# EAGLE design what-the-frequency-mk-5 (EAGLE 6.5.0)
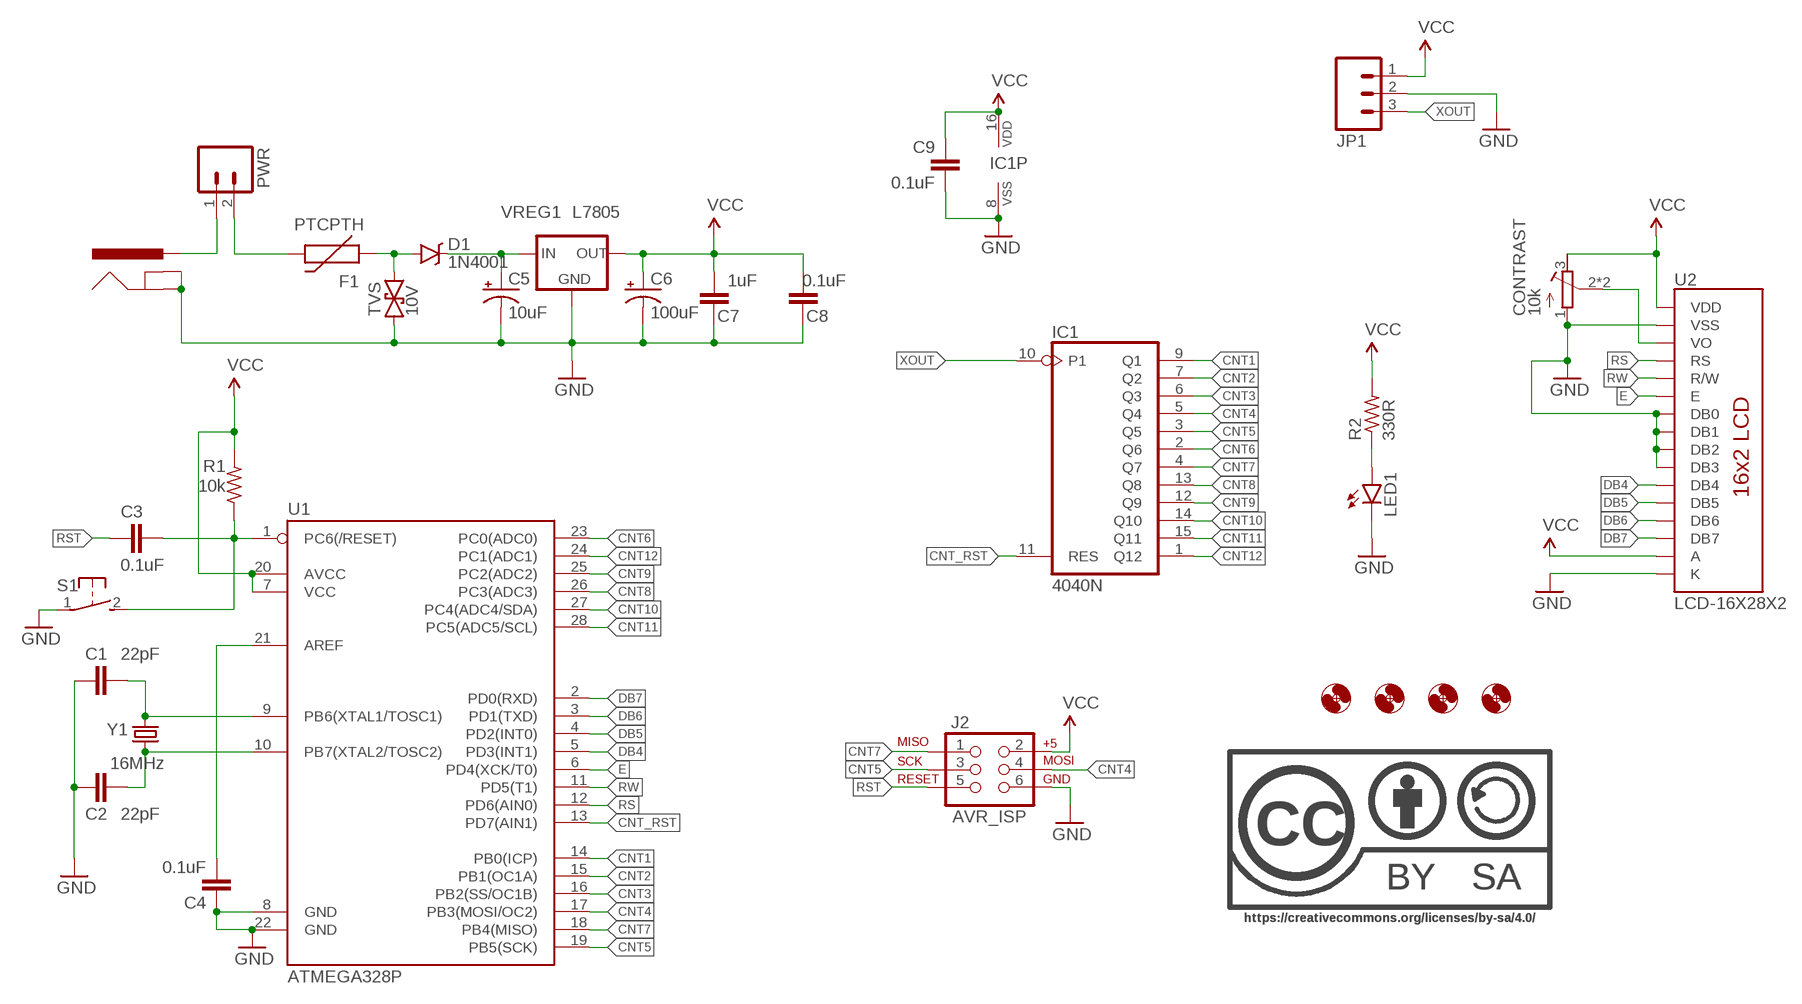
[diagram p0: schematic, sheet 1]

## Parts
C1  22pF  CAPACITOR-CERAMIC025-024X044  [C025-024X044]
C2  22pF  CAPACITOR-CERAMIC025-024X044  [C025-024X044]
C3  0.1uF  CAPACITOR-CERAMIC025-024X044  [C025-024X044]
C4  0.1uF  CAPACITOR-CERAMIC025-024X044  [C025-024X044]
C5  10uF  CAPACITOR-POLARIZEDE2-5  [E2-5]
C6  100uF  CAPACITOR-POLARIZEDE2.5-6  [E2,5-6]
C7  1uF  CAPACITOR-CERAMIC025-024X044  [C025-024X044]
C8  0.1uF  CAPACITOR-CERAMIC025-024X044  [C025-024X044]
C9  0.1uF  CAPACITOR-CERAMIC025-024X044  [C025-024X044]
CONTRAST  10k  POTENTIOMETERTHUMBWHEEL-16MM  [POT-THUMBWHEEL]
D1  1N4001  DIODE-SCHOTTKYDO-41  [DO-41]
F1  PTCPTH  [PTC]
H1  HOLE#4  [HOLE-#4]
H2  HOLE#4  [HOLE-#4]
H3  HOLE#4  [HOLE-#4]
H4  HOLE#4  [HOLE-#4]
IC1  4040N  [DIL16]
J1  POWER_JACKPTH  [POWER_JACK_PTH]
J2  AVR_ISP  AVR_SPI_PRG_6INLINE  [AVR_MINI_PROG]
JP1  M03PTH  [1X03]
LED1  LED3MM  [LED3MM]
PWR  M02PTH  [1X02]
R1  10k  RESISTORPTH-AXIAL-7.68MM  [RESISTOR-AXIAL-PTH-7.68MM]
R2  330R  RESISTORPTH-AXIAL-6.35MM  [RESISTOR-AXIAL-PTH-6.35MM]
S1  DTS-3  [DTS-3]
TVS  10V  TVSDO-41-TVS-BIDIRECTIONAL  [DO-41-TVS]
U1  ATMEGA328P  ATMEGA328P_PDIP  [DIL28-3]
U2  LCD-16X28X2  [LCD-8X2]
U$3  CC-BY-SA-4.0NO-URL  [CC-BY-SA-4.0-NO-URL]
U$7  CC-BY-SA-4.0NO-URL  [CC-BY-SA-4.0-NO-URL]
VREG1  L7805  V_REG_78XXTO-220-IGO-VERT  [TO220V]
Y1  16MHz  CRYSTALHC49UV  [HC49U-V]

## Nets
CNT1: IC1.9(Q1) U1.14(PB0(ICP))
CNT2: IC1.7(Q2) U1.15(PB1(OC1A))
CNT3: IC1.6(Q3) U1.16(PB2(SS/OC1B))
CNT4: IC1.5(Q4) J2.4 U1.17(PB3(MOSI/OC2))
CNT5: IC1.3(Q5) J2.3 U1.19(PB5(SCK))
CNT6: IC1.2(Q6) U1.23(PC0(ADC0))
CNT7: IC1.4(Q7) J2.1 U1.18(PB4(MISO))
CNT8: IC1.13(Q8) U1.26(PC3(ADC3))
CNT9: IC1.12(Q9) U1.25(PC2(ADC2))
CNT10: IC1.14(Q10) U1.27(PC4(ADC4/SDA))
CNT11: IC1.15(Q11) U1.28(PC5(ADC5/SCL))
CNT12: IC1.1(Q12) U1.24(PC1(ADC1))
CNT_RST: IC1.11(RES) U1.13(PD7(AIN1))
DB4: U1.5(PD3(INT1)) U2.11(DB4)
DB5: U1.4(PD2(INT0)) U2.12(DB5)
DB6: U1.3(PD1(TXD)) U2.13(DB6)
DB7: U1.2(PD0(RXD)) U2.14(DB7)
E: U1.6(PD4(XCK/T0)) U2.6(E)
GND: C1.2 C2.2 C4.1 C5.- C6.- C7.1 C8.1 C9.1 CONTRAST.1(A) IC1.8(VSS) J1.GND J1.GNDBREAK J2.6 JP1.2 LED1.K(C) S1.1 TVS.P$1 U1.8(GND) U1.22(GND) U2.1(VSS) U2.7(DB0) U2.8(DB1) U2.9(DB2) U2.10(DB3) U2.16(K) VREG1.2(GND)
N$1: C5.+ D1.C VREG1.1(IN)
N$2: LED1.A R2.P$1
N$3: J1.PWR PWR.1
N$4: D1.A F1.P$1 TVS.P$2
N$5: F1.P$2 PWR.2
N$6: C1.1 U1.9(PB6(XTAL1/TOSC1)) Y1.2
N$7: C2.1 U1.10(PB7(XTAL2/TOSC2)) Y1.1
N$8: C4.2 U1.21(AREF)
N$9: CONTRAST.2(S) CONTRAST.2@1(S) U2.3(VO)
N$11: C3.2 R1.P$1 S1.2 U1.1(PC6(/RESET))
RS: U1.12(PD6(AIN0)) U2.4(RS)
RST: C3.1 J2.5
RW: U1.11(PD5(T1)) U2.5(R/W)
VCC: C6.+ C7.2 C8.2 C9.2 CONTRAST.3(E) IC1.16(VDD) J2.2 JP1.1 R1.P$2 R2.P$2 U1.7(VCC) U1.20(AVCC) U2.2(VDD) U2.15(A) VREG1.3(OUT)
XOUT: IC1.10(P1) JP1.3

## Library data of the parts
C1-C4 C7-C9 = A_butts:CAPACITOR-CERAMIC: CAPACITOR, European symbol
C5 C6 = A_butts:CAPACITOR-POLARIZED: POLARIZED CAPACITOR, American symbol
CONTRAST = A_butts:POTENTIOMETER: Trimm resistor
D1 = A_butts:DIODE-SCHOTTKY: Schottky diodes in SFE's production catalog BAT20J 1A 23V 0.62Vf RB751 120mA 40V 0.37Vf PMEG4005EJ 0.5A 40V 0.42Vf MBRA140 1A 40V 0.5Vf B340A 3A 40V SMA
F1 = A_butts:PTC: Resettable Fuse PTC Resettable Fuse. Spark Fun Electronics SKU : COM-08357
H1-H4 = A_butts:HOLE: MOUNTING HOLE with drill center marker
IC1 = A_butts:4040: 12-stage binary/ripple COUNTER
J1 = SparkFun-Connectors:POWER_JACK: Power Jack This is the standard 5.5mm barrel jack for power. The PTH is the most common, proven, reliable, footprint. The Slot footprint only works if the mill layer is transmitted to the PCB fab house so be warned. Mating wall wart : TOL-00298 (and others); PROD_ID: PRT-00119
J2 = A_butts:AVR_SPI_PRG_6: AVR ISP 6 Pin This is the reduced ISP connector for AVR programming. Common on Arduino. This footprint will take up less PCB space and can be used with a 10-pin to 6-pin adapter such as SKU: BOB-08508 **Special note about "TEST_POINT" package. The stop mask is on the top side, so if you want your programming test points to be on the bottom of your board, make sure to place this package on the bottom side of the board. This also ensure that the orientation to program from the bottom side will be correct.
JP1 = A_butts:M03: Header 3 Standard 3-pin 0.1" header. Use with straight break away headers (SKU : PRT-00116), right angle break away headers (PRT-00553), swiss pins (PRT-00743), machine pins (PRT-00117), and female headers (PRT-00115). Molex polarized connector foot print use with SKU : PRT-08232 with associated crimp pins and housings.
LED1 = A_butts:LED: LEDs Standard schematic elements and footprints for 5mm, 3mm, 1206, and 0603 sized LEDs. 5mm - Spark Fun Electronics SKU : COM-00529 (and others)
PWR = A_butts:M02: Standard 2-pin 0.1" header. Use with - straight break away headers ( PRT-00116) - right angle break away headers (PRT-00553) - swiss pins (PRT-00743) - machine pins (PRT-00117) - female headers (PRT-00115) Molex polarized connector foot print use with: PRT-08233 with associated crimp pins and housings. 2.54_SCREWTERM for use with PRT-10571. 3.5mm Screw Terminal footprints for PRT-08084 5mm Screw Terminal footprints for use with PRT-08433
R1 R2 = A_butts:RESISTOR: RESISTOR, American symbol
S1 = switch-tact:DTS-3
TVS = A_butts:TVS: Transient voltage suppressor- prevents ESD on inputs. Ignore package description- MBRA140 is NOT this type of part!!!
U1 = SparkFun-DigitalIC:ATMEGA328P_PDIP: uC used in the Arduino 32kb flash, 1k EEPROM, 2k SRAM This is the through-hole version of this chip.
U2 = A_butts:LCD-16X2: Standard text-only 16x2 parallel input LCD
U$3 U$7 = A_butts:CC-BY-SA-4.0
VREG1 = A_butts:V_REG_78XX: Voltage Regulator Standard 7805 5V regulator. IGO (Input Ground Output). Spark Fun Electronics SKU : COM-00107
Y1 = SparkFun-FreqCtrl:CRYSTAL: Various standard crystals. Proven footprints. Spark Fun Electronics SKU : COM-00534

## Board
What's the Frequency, Arduino? What's the Frequency, Arduino? Frequency counter with LCD display, banana jack, and DC barrel jack with a 5V regulator built-in (as opposed to the one on SparkFun which lacks the more robust internal connections, but is cheaper. Designed to fit in a Hammond 1591XXABK/1591XXAGY enclosure, though you'll need to cut holes for the various external bits.
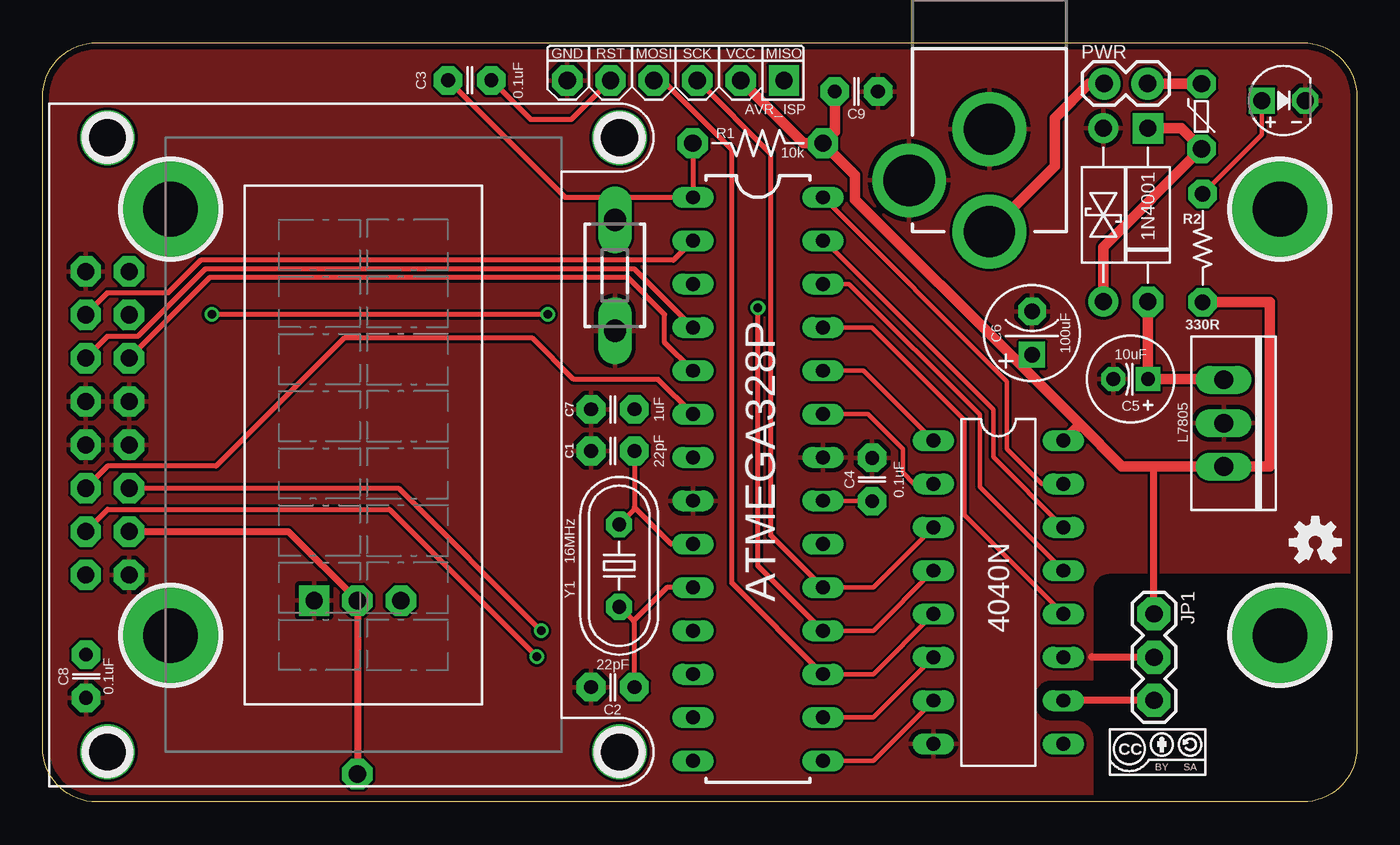
[diagram p1: board, top side]
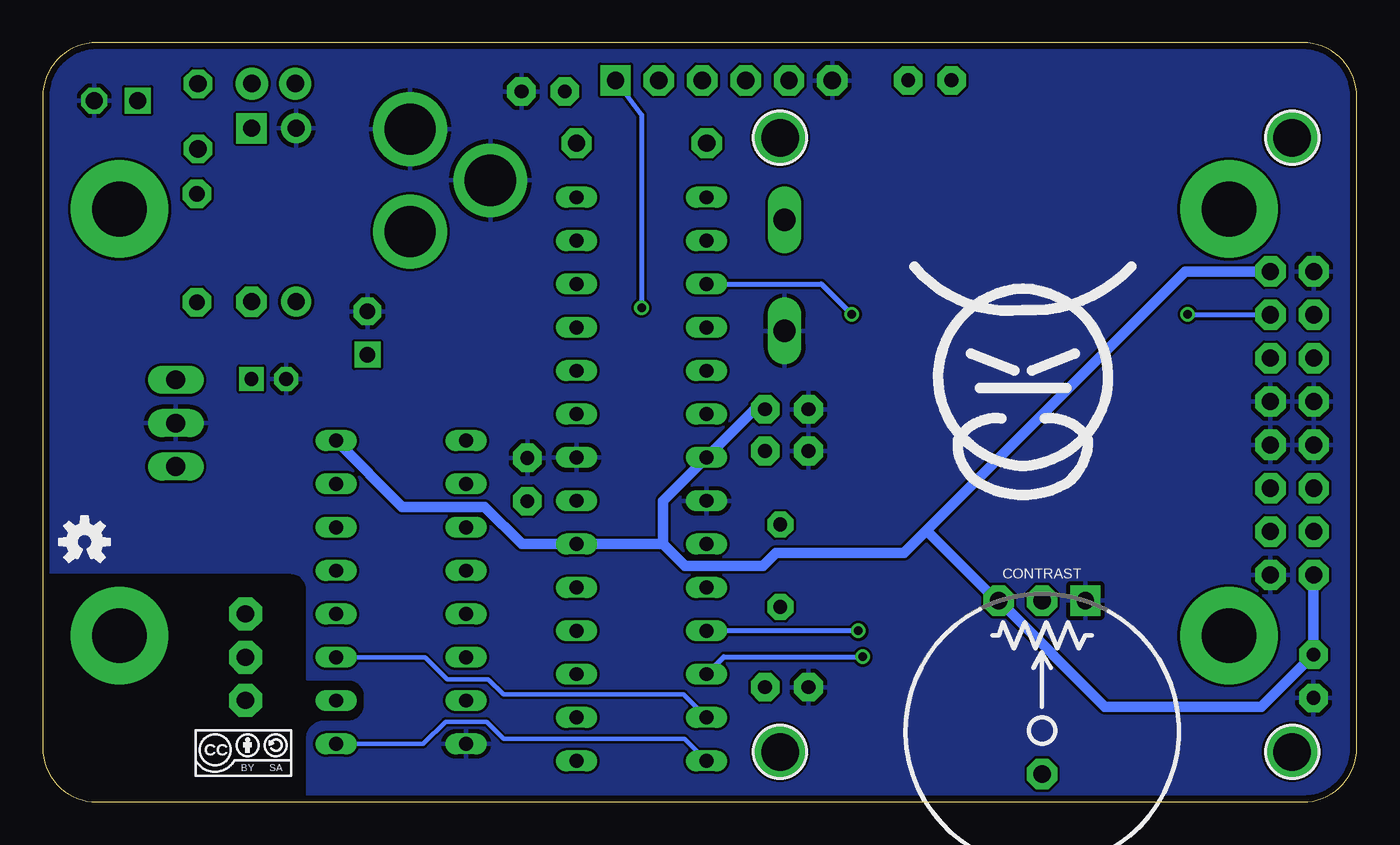
[diagram p2: board, bottom side, seen from below]

Size 77 x 44.5 mm. Coordinates in mm from the lower left corner, seen from the top.
Outline: 0,3.17 0,41.33 arc-90 3.17,44.5 73.83,44.5 arc-90 77,41.33 77,3.17 arc-90 73.83,0 3.17,0 arc-90 0,3.17
Copper layers (1*16): Top 0.0356mm / dielectric 1.5011mm / Bottom 0.0356mm
Design rules "LaenPCBOrder2": minimum track width 6mil, minimum drill 13mil, track to track 6mil, track to pad 6mil, pad to pad 6mil, via to via 6mil, smd to smd 6mil, copper to edge 15mil, drill to drill 6mil, minimum pad ring 7mil, minimum via ring 7mil, stop-mask expansion 3mil, vias tented up to drill 20mil, thermal gap 10mil

### Footprints (pad centres in the part's own frame; a part is rotated, then mirrored left to right if it is on the bottom)
C025-024X044 = drill 0.813 pad 1.676 octagon: 1 -1.27,0; 2 1.27,0
E2-5 = drill 0.813 pad 1.422 square: + -1.016,0 | drill 0.813 pad 1.422 octagon: - 1.016,0
E2,5-6 = drill 0.9 pad 1.524 square: + -1.27,0 | drill 0.9 pad 1.6 octagon: - 1.27,0
POT-THUMBWHEEL = drill 1.016 pad 1.778 square: 1 -2.54,0 | drill 1.016 pad 1.778 octagon: 2 0,0; 2@1 0,10.16; 3 2.54,0
DO-41 = drill 1 pad 1.778 square: A -5.08,0 | drill 1 pad 1.778 octagon: C 5.08,0
PTC = drill 1.016 pad 1.676 octagon: P$1 -1.905,0; P$2 1.905,0
HOLE-#4 = drill 3.2 pad 5.715: P$1 0,0
DIL16 = drill 0.813 long: 1 -8.89,-3.81; 2 -6.35,-3.81; 3 -3.81,-3.81; 4 -1.27,-3.81; 5 1.27,-3.81; 6 3.81,-3.81; 7 6.35,-3.81; 8 8.89,-3.81; 9 8.89,3.81; 10 6.35,3.81; 11 3.81,3.81; 12 1.27,3.81; 13 -1.27,3.81; 14 -3.81,3.81; 15 -6.35,3.81; 16 -8.89,3.81
POWER_JACK_PTH = drill 2.997 pad 4.318: GND 0,7.7; GNDBREAK 4.7,10.7; PWR 0,13.7
AVR_MINI_PROG = drill 1.016 pad 1.778 square: 1 0,0 | drill 1.016 pad 1.778 octagon: 2 2.54,0; 3 5.08,0; 4 7.62,0; 5 10.16,0; 6 12.7,0.01
1X03 = drill 1 pad 1.93 octagon: 1 0,0; 2 2.54,0; 3 5.08,0
LED3MM = drill 1 pad 1.524 square: A -1.27,0 | drill 1 pad 1.524 octagon: K 1.27,0
1X02 = drill 1.016 pad 1.88: 1 0,0; 2 2.54,0
RESISTOR-AXIAL-PTH-7.68MM = drill 1.016 pad 1.778 octagon: P$1 -3.81,0; P$2 3.81,0
RESISTOR-AXIAL-PTH-6.35MM = drill 0.9 pad 1.676 octagon: P$1 -3.175,0; P$2 3.175,0
DTS-3 = drill 1.3 long: 1 -3.25,0; 2 3.25,0
DO-41-TVS = drill 1 pad 1.778: P$1 -5.08,0; P$2 5.08,0
DIL28-3 = drill 0.813 long: 1 -16.51,-3.81; 2 -13.97,-3.81; 3 -11.43,-3.81; 4 -8.89,-3.81; 5 -6.35,-3.81; 6 -3.81,-3.81; 7 -1.27,-3.81; 8 1.27,-3.81; 9 3.81,-3.81; 10 6.35,-3.81; 11 8.89,-3.81; 12 11.43,-3.81; 13 13.97,-3.81; 14 16.51,-3.81; 15 16.51,3.81; 16 13.97,3.81; 17 11.43,3.81; 18 8.89,3.81; 19 6.35,3.81; 20 3.81,3.81; 21 1.27,3.81; 22 -1.27,3.81; 23 -3.81,3.81; 24 -6.35,3.81; 25 -8.89,3.81; 26 -11.43,3.81; 27 -13.97,3.81; 28 -16.51,3.81
LCD-8X2 = drill 1 pad 1.778 octagon: 1 -7.62,13.73; 2 -7.62,16.27; 3 -5.08,13.73; 4 -5.08,16.27; 5 -2.54,13.73; 6 -2.54,16.27; 7 0,13.73; 8 0,16.27; 9 2.54,13.73; 10 2.54,16.27; 11 5.08,13.73; 12 5.08,16.27; 13 7.62,13.73; 14 7.62,16.27; 15 10.16,13.73; 16 10.16,16.27 | drill 2.2 pad 3: P$1 -18,-15; P$2 -18,15; P$3 18,15; P$4 18,-15
TO220V = drill 1.1 long: 1 -2.54,0; 2 0,0; 3 2.54,0
HC49U-V = drill 0.813 pad 1.524 octagon: 1 -2.413,0; 2 2.413,0

### Placement (x,y rotation side)
C1  33.4,20.57 180 top
C2  33.4,6.73 180 top
C3  25.02,42.29 180 top
C4  48.6,18.9 270 top
C5  63.75,24.78 180 top
C6  57.97,27.48 90 top
C7  33.4,23.01 0 top
C8  2.54,7.37 90 top
C9  47.68,41.64 180 top
CONTRAST  18.44,11.8 180 bottom
D1  64.77,34.4 270 top
F1  67.9,40.19 90 top
H1  7.49,9.75 0 top
H2  7.49,34.75 0 top
H3  72.49,9.75 0 top
H4  72.49,34.75 0 top
IC1  56,12.29 270 top
J1  55.47,47.13 180 top
J2  43.43,42.29 180 top
JP1  65.12,11.03 270 top
LED1  72.7,41.11 0 top
PWR  62.2,42.1 0 top
R1  41.91,38.61 0 top
R2  67.97,32.47 270 top
S1  33.53,30.86 90 top
TVS  62.15,34.41 270 top
U1  41.91,18.92 270 top
U2  18.8,20.93 90 top
U$2  [OSHW-LOGO-S]  74.56,15.21 0 top
U$3  66.9,3.07 0 bottom
U$4  [OSHW-LOGO-S]  74.55,15.24 0 bottom
U$7  63.67,3.11 0 top
U$8  [COW]  19.56,23.75 0 bottom
VREG1  69.2,22.2 270 top
Y1  33.78,13.84 90 top

### Tracks (layer width: path | path; a pad name or v marks a point on that pad's centre or on a via)
CNT1
  Bottom 0.254: U1.14 39.39,3.7 50,3.7 51,4.7 53.4,4.7 54.7,3.4 IC1.9
CNT2
  Top 0.254: U1.15 48.66,2.41 IC1.7
CNT3
  Top 0.254: U1.16 48.66,4.95 IC1.6
CNT4
  Top 0.254: U1.17 48.66,7.49 IC1.5
  Top 0.305: U1.17 40.39,12.83 40.39,38.23 36.32,42.29 J2.4
CNT5
  Top 0.254: U1.19 48.66,12.57 IC1.3
  Top 0.305: U1.19 42.67,15.62 42.67,37.97 J2.3
CNT6
  Top 0.254: U1.23 48.37,22.73 50.4,20.7 50.4,19.3 51.06,18.64 IC1.2
CNT7  (via drill 0.5)
  Top 0.254: U1.18 48.66,10.03 IC1.4
  Top 0.305: U1.18 41.91,13.84 v41.91,28.96
  Bottom 0.305: J2.1 41.91,40.26 v41.91,28.96
CNT8
  Top 0.254: IC1.13 54.9,18.47 54.9,22.7 47.25,30.35 U1.26
CNT9
  Top 0.254: U1.25 48.59,27.81 54,22.4 54,16.83 IC1.12
CNT10
  Top 0.254: IC1.14 55.7,20.21 55.7,23 45.81,32.89 U1.27
CNT11
  Top 0.254: U1.28 56.5,24.65 56.5,20.7 58.56,18.64 IC1.15
CNT12
  Top 0.254: U1.24 48.1,25.27 IC1.1
CNT_RST
  Bottom 0.254: U1.13 39.45,6.3 50,6.3 50.9,7.2 53.3,7.2 54.58,8.48 IC1.11
DB4
  Top 0.305: U1.5 36.45,26.92 36.45,28.57 34.29,30.73 9.79,30.73 U2.11
DB5
  Top 0.305: U1.4 34.67,31.24 9.53,31.24 5.59,27.3 3.81,27.3 2.53,26.02 U2.12
DB6  (via drill 0.5)
  Top 0.305: v29.59,28.57 v9.91,28.57
  Bottom 0.305: U1.3 31.37,30.35 v29.59,28.57 | U2.13 9.88,28.55 v9.91,28.57
DB7
  Top 0.305: U1.2 36.96,31.75 9.27,31.75 7.37,29.84 3.81,29.84 U2.14
E
  Top 0.305: U1.6 36.07,24.77 31.11,24.77 28.7,27.18 17.65,27.18 10.16,19.68 3.81,19.68 U2.6
GND
  Top 0.406: JP1.2 61.47,8.48 61.47,8.51
  pour Bottom: 61.5,0 3.17,0 arc-90 0,3.17 0,41.33 arc-90 3.17,44.5 73.83,44.5 arc-90 77,41.33 77,13.44 62.5,13.44 arc90 61.5,12.44 61.5,7.2 59.1,7.2 arc90 58.1,6.2 58.1,5.7 arc90 59.1,4.7 60.5,4.7 arc-90 61.5,3.7
  pour Top: 61.5,0 3.17,0 arc-90 0,3.17 0,41.33 arc-90 3.17,44.5 73.83,44.5 arc-90 77,41.33 77,13.44 62.5,13.44 arc90 61.5,12.44 61.5,7.2 59.1,7.2 arc90 58.1,6.2 58.1,5.7 arc90 59.1,4.7 60.5,4.7 arc-90 61.5,3.7
N$1
  Top 0.61: D1.C C5.+ 69.2,24.78 VREG1.1
N$2
  Top 0.254: R2.P$1 71.43,39.11 LED1.A
N$3
  Top 0.61: J1.PWR 59.3,37.26 59.3,40.09 61.31,42.1 PWR.1
N$4
  Top 0.61: TVS.P$2 62.15,32.53 F1.P$1 66.7,39.48 D1.A
N$5
  Top 0.61: PWR.2 F1.P$2
N$6
  Top 0.305: U1.9 36.83,15.11 34.67,17.27 | C1.1 34.67,17.27 | 34.67,17.27 34.67,17.14 Y1.2
N$7
  Top 0.305: C2.1 34.67,10.54 34.61,10.6 | 34.61,10.6 Y1.1 | U1.10 36.58,12.57 34.61,10.6
N$8
  Top 0.254: C4.2 48.58,17.65 U1.21
N$9
  Top 0.406: U2.3 14.4,15.85 CONTRAST.2 CONTRAST.2@1
N$11
  Top 0.305: R1.P$1 U1.1 33.53,35.43 | C3.2 30.61,35.43 33.53,35.43 | S1.2 33.53,35.43
RS  (via drill 0.5)
  Top 0.305: v28.96,8.51 20.32,17.14 3.81,17.14 2.53,15.86 U2.4
  Bottom 0.305: U1.12 37.08,8.51 v28.96,8.51
RST
  Top 0.305: C3.1 28.57,40.01 30.99,40.01 J2.5
RW  (via drill 0.5)
  Top 0.305: U2.5 20.85,18.39 v29.21,10.03
  Bottom 0.305: v29.21,10.03 U1.11
VCC
  Top 0.406: JP1.1 65.12,19.66 65.02,19.66
  Top 0.61: J2.2 44.58,38.61 R1.P$2 | R1.P$2 46.41,39.3 C9.2 | R1.P$2 47.6,36.73 47.6,35.3 57.45,25.45 | 57.45,25.45 60.7,22.2 | 60.7,22.2 63.24,19.66 65.02,19.66 VREG1.3 71.9,19.66 71.9,29.3 R2.P$2 | IC1.16 60.7,22.07 60.7,22.2 | C6.+ 57.45,25.69 57.45,25.45
  Bottom 0.61: U2.15 10.06,31.09 25.22,15.92 | 25.22,15.92 26.54,14.61 34.04,14.61 34.8,13.84 39.37,13.84 40.64,15.11 | C7.2 35.28,23.01 U1.7 40.64,17.65 40.64,15.11 | U2.2 2.54,13.3 C8.2 5.59,5.59 14.77,5.59 CONTRAST.3 21.11,11.8 25.22,15.92 | IC1.16 55.93,17.3 51.1,17.3 48.91,15.11 U1.20 40.64,15.11
XOUT
  Top 0.406: JP1.3 IC1.10